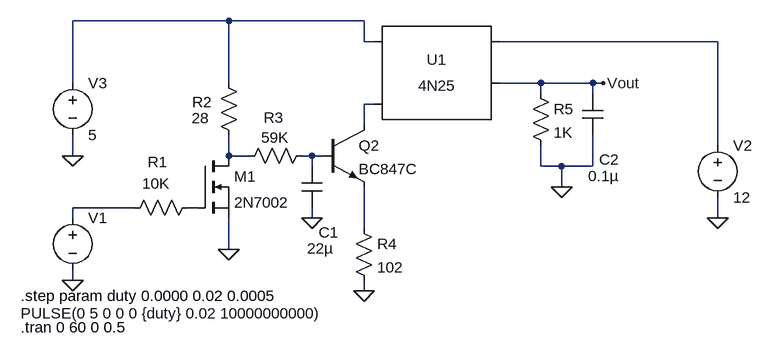
[diagram p0: schematic 0-10V.asc]
0-10V.asc, the LTspice schematic file:
Version 4.1
SHEET 1 920 680
WIRE 112 -112 -128 -112
WIRE 320 -112 112 -112
WIRE 320 -80 320 -112
WIRE 336 -80 320 -80
WIRE 864 -80 528 -80
WIRE -128 -16 -128 -112
WIRE 112 -16 112 -112
WIRE 592 -16 528 -16
WIRE 672 -16 592 -16
WIRE 688 -16 672 -16
WIRE 592 0 592 -16
WIRE 672 0 672 -16
WIRE 336 16 320 16
WIRE 320 48 320 16
WIRE 864 80 864 -80
WIRE -128 96 -128 64
WIRE 112 96 112 64
WIRE 144 96 112 96
WIRE 240 96 224 96
WIRE 256 96 240 96
WIRE 240 112 240 96
WIRE 592 112 592 80
WIRE 624 112 592 112
WIRE 672 112 672 64
WIRE 672 112 624 112
WIRE 624 144 624 112
WIRE -32 176 -128 176
WIRE 64 176 48 176
WIRE -128 192 -128 176
WIRE 240 192 240 176
WIRE 864 192 864 160
WIRE 320 208 320 144
WIRE 112 240 112 192
WIRE -128 288 -128 272
WIRE 320 304 320 288
FLAG 112 240 0
FLAG 240 192 0
FLAG 688 -16 Vout
FLAG -128 288 0
FLAG 864 192 0
FLAG 320 304 0
FLAG 624 144 0
FLAG -128 96 0
SYMBOL res 64 160 R90
WINDOW 0 -39 61 VBottom 2
WINDOW 3 -37 64 VTop 2
SYMATTR InstName R1
SYMATTR Value 10K
SYMBOL res 96 -32 R0
WINDOW 0 -40 45 Left 2
WINDOW 3 -41 70 Left 2
SYMATTR InstName R2
SYMATTR Value 28
SYMBOL res 240 80 R90
WINDOW 0 -27 59 VBottom 2
WINDOW 3 -28 57 VTop 2
SYMATTR InstName R3
SYMATTR Value 59K
SYMBOL cap 224 112 R0
WINDOW 0 26 102 Left 2
WINDOW 3 9 127 Left 2
SYMATTR InstName C1
SYMATTR Value 22µ
SYMBOL npn 256 48 R0
SYMATTR InstName Q2
SYMATTR Value BC847C
SYMBOL voltage -128 176 R0
WINDOW 3 -80 163 Left 2
WINDOW 123 0 0 Left 0
WINDOW 39 0 0 Left 0
SYMATTR Value PULSE(0 5 0 0 0 {duty} 0.02 10000000000)
SYMATTR InstName V1
SYMBOL voltage 864 64 R0
WINDOW 123 0 0 Left 0
WINDOW 39 0 0 Left 0
SYMATTR InstName V2
SYMATTR Value 12
SYMBOL nmos 64 96 R0
SYMATTR InstName M1
SYMATTR Value 2N7002
SYMBOL res 304 192 R0
SYMATTR InstName R4
SYMATTR Value 102
SYMBOL Optos\\4N25 432 -16 R0
SYMATTR InstName U1
SYMBOL res 576 -16 R0
SYMATTR InstName R5
SYMATTR Value 1K
SYMBOL cap 656 0 R0
WINDOW 0 26 102 Left 2
WINDOW 3 9 127 Left 2
SYMATTR InstName C2
SYMATTR Value 0.1µ
SYMBOL voltage -128 -32 R0
WINDOW 123 0 0 Left 0
WINDOW 39 0 0 Left 0
SYMATTR InstName V3
SYMATTR Value 5
TEXT -208 360 Left 2 !.tran 0 60 0 0.5
TEXT -208 312 Left 2 !.step param duty 0.0000 0.02 0.0005

The netlist it stands for:
* 0-10V.asc
R1 N007 N006 10K
R2 N001 N004 28
R3 N005 N004 59K
C1 N005 0 22µ
Q2 N003 N005 N008 0 BC847C
V1 N006 0 PULSE(0 5 0 0 0 {duty} 0.02 10000000000)
V2 N002 0 12
M1 N004 N007 0 0 2N7002
R4 N008 0 102
X§U1 N001 N003 N002 Vout NC_01 4N25
R5 Vout 0 1K
C2 Vout 0 0.1µ
V3 N001 0 5
.model NPN NPN
.model PNP PNP
.lib standard.bjt
.model NMOS NMOS
.model PMOS PMOS
.lib standard.mos
.tran 0 60 0 0.5
.step param duty 0.0000 0.02 0.0005
.lib 4N25.sub
.backanno
.end